# EAGLE schematic micromouse_schematic (EAGLE 8.6.3)
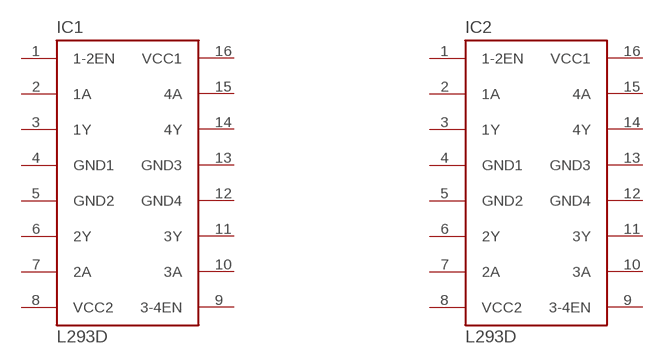
[diagram p0: schematic, sheet 1]

## Parts
IC1  L293D  [DIL16]
IC2  L293D  [DIL16]
Unconnected: IC1.1(1-2EN) IC1.2(1A) IC1.3(1Y) IC1.6(2Y) IC1.7(2A) IC1.9(3-4EN) IC1.10(3A) IC1.11(3Y) IC1.14(4Y) IC1.15(4A) IC2.1(1-2EN) IC2.2(1A) IC2.3(1Y) IC2.6(2Y) IC2.7(2A) IC2.9(3-4EN) IC2.10(3A) IC2.11(3Y) IC2.14(4Y) IC2.15(4A)

## Power pins joined to a net without a drawn wire
GND1: IC1.4(GND1) IC2.4(GND1)
GND2: IC1.5(GND2) IC2.5(GND2)
GND3: IC1.13(GND3) IC2.13(GND3)
GND4: IC1.12(GND4) IC2.12(GND4)
VCC1: IC1.16(VCC1) IC2.16(VCC1)
VCC2: IC1.8(VCC2) IC2.8(VCC2)

## Library data of the parts
IC1 IC2 = st-microelectronics:L293D: PUSH-PULL 4 CHANNEL DRIVER; MPN: L293D; OC_FARNELL: 9589619; OC_NEWARK: 56P8249